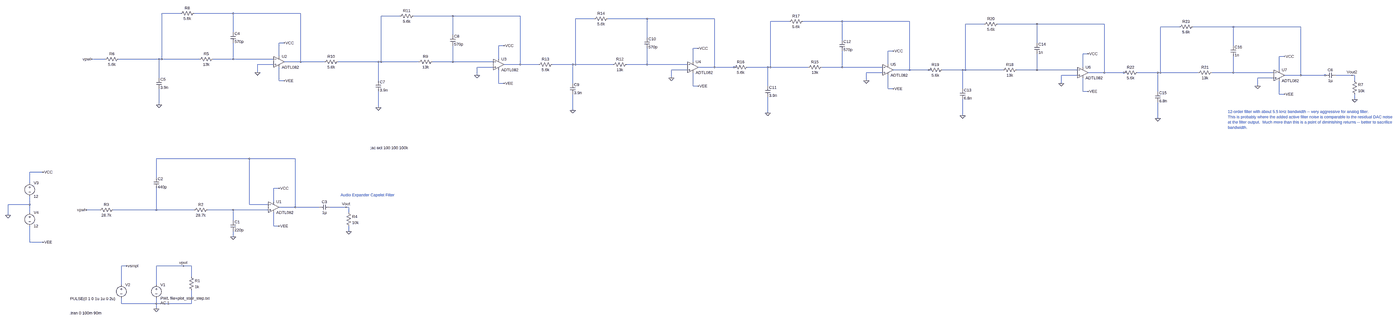
[diagram p0: schematic Audio_Cape_Output.asc, whole sheet]
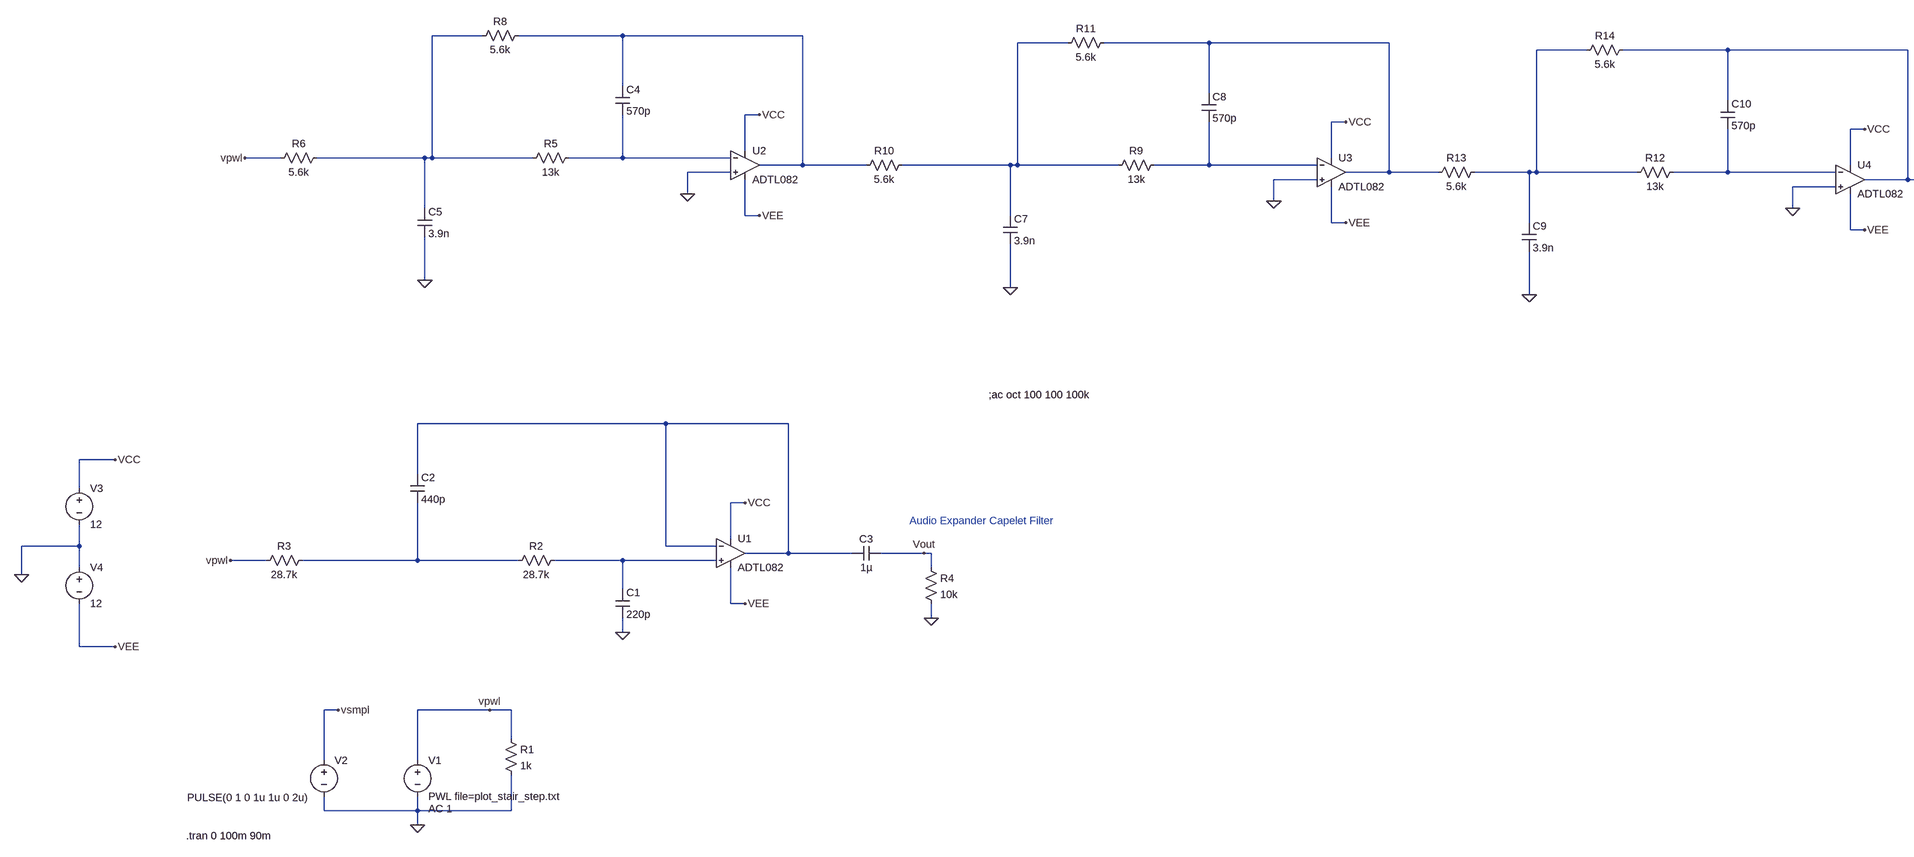
[diagram p1: schematic Audio_Cape_Output.asc, part, row 1 of 1, column 1 of 2]
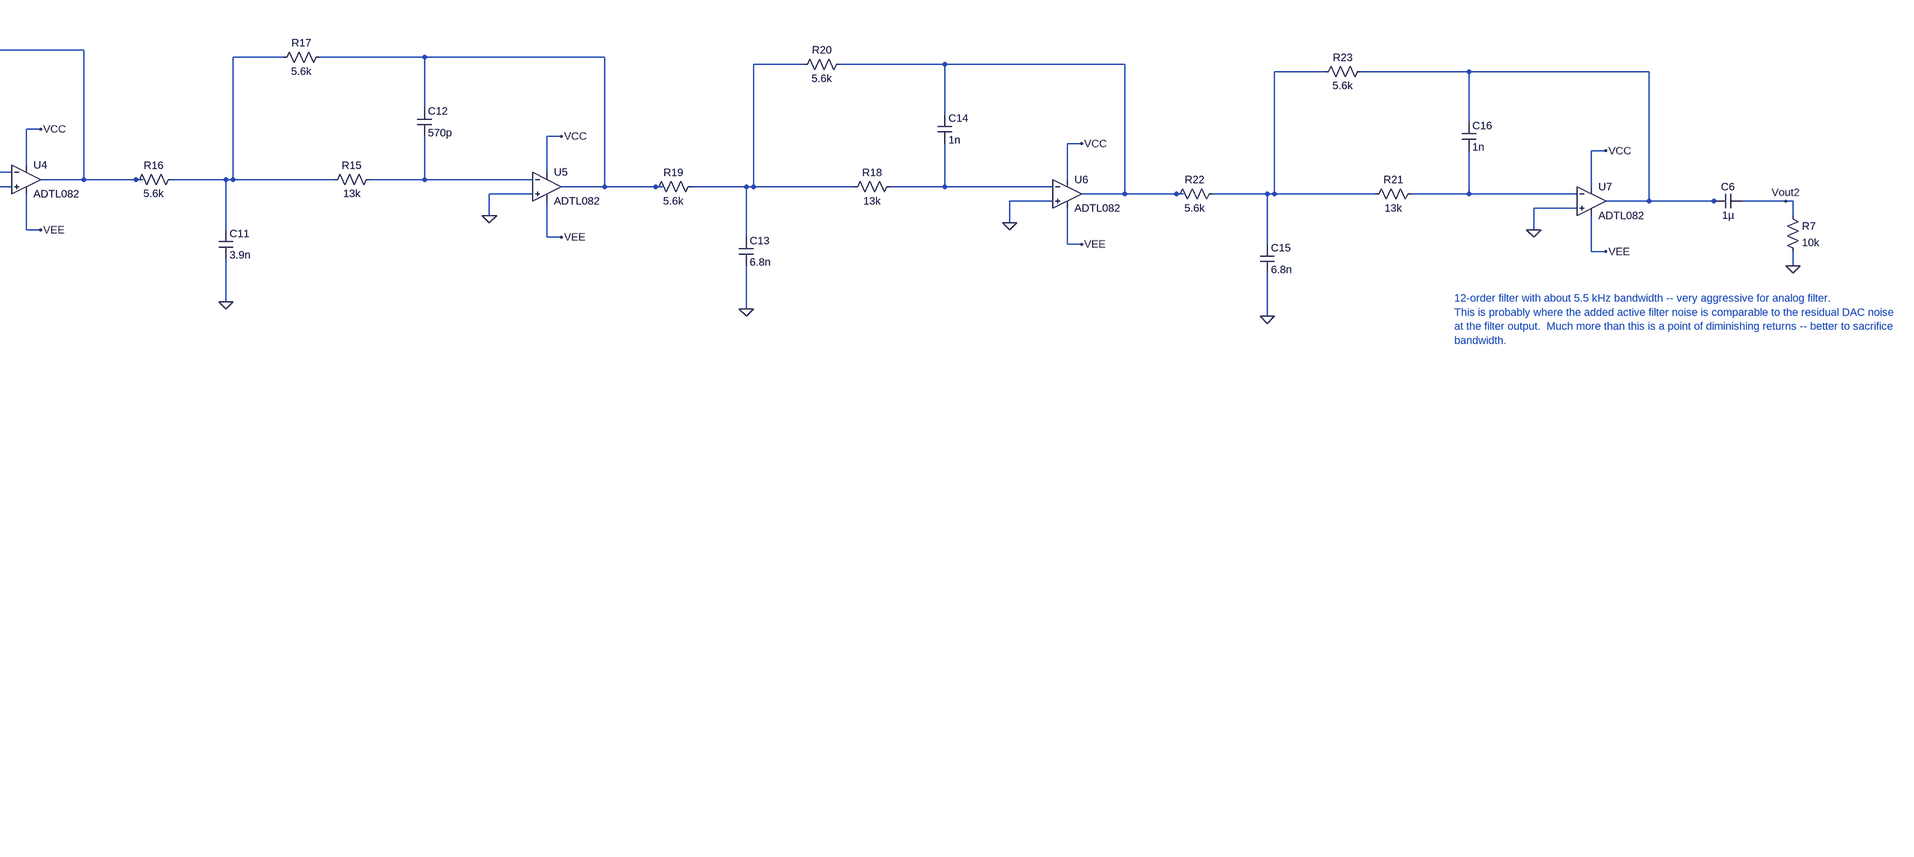
[diagram p2: schematic Audio_Cape_Output.asc, part, row 1 of 1, column 2 of 2]
Audio_Cape_Output.asc, the LTspice schematic file:
Version 4
SHEET 1 8220 680
WIRE 256 -1856 144 -1856
WIRE 576 -1856 336 -1856
WIRE 976 -1856 576 -1856
WIRE 1584 -1840 1472 -1840
WIRE 1904 -1840 1664 -1840
WIRE 2304 -1840 1904 -1840
WIRE 2912 -1824 2800 -1824
WIRE 3232 -1824 2992 -1824
WIRE 3632 -1824 3232 -1824
WIRE 4224 -1808 4112 -1808
WIRE 4544 -1808 4304 -1808
WIRE 4944 -1808 4544 -1808
WIRE 5552 -1792 5440 -1792
WIRE 5872 -1792 5632 -1792
WIRE 6272 -1792 5872 -1792
WIRE 6880 -1776 6768 -1776
WIRE 7200 -1776 6960 -1776
WIRE 7600 -1776 7200 -1776
WIRE 576 -1744 576 -1856
WIRE 1904 -1728 1904 -1840
WIRE 3232 -1712 3232 -1824
WIRE 4544 -1696 4544 -1808
WIRE 880 -1680 848 -1680
WIRE 5872 -1680 5872 -1792
WIRE 2208 -1664 2176 -1664
WIRE 7200 -1664 7200 -1776
WIRE 3536 -1648 3504 -1648
WIRE 4848 -1632 4816 -1632
WIRE 6176 -1616 6144 -1616
WIRE 848 -1600 848 -1680
WIRE 7504 -1600 7472 -1600
WIRE -192 -1584 -272 -1584
WIRE 128 -1584 -112 -1584
WIRE 144 -1584 144 -1856
WIRE 144 -1584 128 -1584
WIRE 368 -1584 144 -1584
WIRE 576 -1584 576 -1680
WIRE 576 -1584 448 -1584
WIRE 816 -1584 576 -1584
WIRE 2176 -1584 2176 -1664
WIRE 976 -1568 976 -1856
WIRE 976 -1568 880 -1568
WIRE 1136 -1568 976 -1568
WIRE 1456 -1568 1216 -1568
WIRE 1472 -1568 1472 -1840
WIRE 1472 -1568 1456 -1568
WIRE 1696 -1568 1472 -1568
WIRE 1904 -1568 1904 -1664
WIRE 1904 -1568 1776 -1568
WIRE 2144 -1568 1904 -1568
WIRE 3504 -1568 3504 -1648
WIRE 816 -1552 720 -1552
WIRE 2304 -1552 2304 -1840
WIRE 2304 -1552 2208 -1552
WIRE 2464 -1552 2304 -1552
WIRE 2784 -1552 2544 -1552
WIRE 2800 -1552 2800 -1824
WIRE 2800 -1552 2784 -1552
WIRE 3024 -1552 2800 -1552
WIRE 3232 -1552 3232 -1648
WIRE 3232 -1552 3104 -1552
WIRE 3472 -1552 3232 -1552
WIRE 4816 -1552 4816 -1632
WIRE 2144 -1536 2048 -1536
WIRE 3632 -1536 3632 -1824
WIRE 3632 -1536 3536 -1536
WIRE 3776 -1536 3632 -1536
WIRE 3792 -1536 3776 -1536
WIRE 4096 -1536 3856 -1536
WIRE 4112 -1536 4112 -1808
WIRE 4112 -1536 4096 -1536
WIRE 4336 -1536 4112 -1536
WIRE 4544 -1536 4544 -1632
WIRE 4544 -1536 4416 -1536
WIRE 4784 -1536 4544 -1536
WIRE 6144 -1536 6144 -1616
WIRE 3472 -1520 3376 -1520
WIRE 4944 -1520 4944 -1808
WIRE 4944 -1520 4848 -1520
WIRE 5104 -1520 4944 -1520
WIRE 5120 -1520 5104 -1520
WIRE 5424 -1520 5184 -1520
WIRE 5440 -1520 5440 -1792
WIRE 5440 -1520 5424 -1520
WIRE 5664 -1520 5440 -1520
WIRE 5872 -1520 5872 -1616
WIRE 5872 -1520 5744 -1520
WIRE 6112 -1520 5872 -1520
WIRE 7472 -1520 7472 -1600
WIRE 720 -1504 720 -1552
WIRE 4784 -1504 4688 -1504
WIRE 6272 -1504 6272 -1792
WIRE 6272 -1504 6176 -1504
WIRE 6432 -1504 6272 -1504
WIRE 6448 -1504 6432 -1504
WIRE 6752 -1504 6512 -1504
WIRE 6768 -1504 6768 -1776
WIRE 6768 -1504 6752 -1504
WIRE 6992 -1504 6768 -1504
WIRE 7200 -1504 7200 -1600
WIRE 7200 -1504 7072 -1504
WIRE 7440 -1504 7200 -1504
WIRE 2048 -1488 2048 -1536
WIRE 6112 -1488 6016 -1488
WIRE 7600 -1488 7600 -1776
WIRE 7600 -1488 7504 -1488
WIRE 7744 -1488 7600 -1488
WIRE 7760 -1488 7744 -1488
WIRE 7904 -1488 7808 -1488
WIRE 7920 -1488 7904 -1488
WIRE 128 -1472 128 -1584
WIRE 3376 -1472 3376 -1520
WIRE 7440 -1472 7344 -1472
WIRE 848 -1456 848 -1536
WIRE 880 -1456 848 -1456
WIRE 1456 -1456 1456 -1568
WIRE 4688 -1456 4688 -1504
WIRE 7920 -1456 7920 -1488
WIRE 2176 -1440 2176 -1520
WIRE 2208 -1440 2176 -1440
WIRE 2784 -1440 2784 -1552
WIRE 6016 -1440 6016 -1488
WIRE 3504 -1424 3504 -1504
WIRE 3536 -1424 3504 -1424
WIRE 4096 -1424 4096 -1536
WIRE 7344 -1424 7344 -1472
WIRE 4816 -1408 4816 -1488
WIRE 4848 -1408 4816 -1408
WIRE 5424 -1408 5424 -1520
WIRE 6144 -1392 6144 -1472
WIRE 6176 -1392 6144 -1392
WIRE 6752 -1392 6752 -1504
WIRE 7472 -1376 7472 -1456
WIRE 7504 -1376 7472 -1376
WIRE 7920 -1344 7920 -1376
WIRE 128 -1312 128 -1408
WIRE 1456 -1296 1456 -1392
WIRE 2784 -1280 2784 -1376
WIRE 4096 -1264 4096 -1360
WIRE 5424 -1248 5424 -1344
WIRE 6752 -1232 6752 -1328
WIRE 672 -848 112 -848
WIRE 944 -848 672 -848
WIRE -880 -768 -960 -768
WIRE 112 -736 112 -848
WIRE -960 -704 -960 -768
WIRE 848 -672 816 -672
WIRE 816 -592 816 -672
WIRE -960 -576 -960 -624
WIRE -960 -576 -1088 -576
WIRE 672 -576 672 -848
WIRE 784 -576 672 -576
WIRE 944 -560 944 -848
WIRE 944 -560 848 -560
WIRE 1104 -560 944 -560
WIRE 1264 -560 1168 -560
WIRE 1280 -560 1264 -560
WIRE -224 -544 -304 -544
WIRE 112 -544 112 -672
WIRE 112 -544 -144 -544
WIRE 336 -544 112 -544
WIRE 576 -544 416 -544
WIRE 784 -544 576 -544
WIRE -960 -528 -960 -576
WIRE 1280 -528 1280 -560
WIRE -1088 -512 -1088 -576
WIRE 576 -480 576 -544
WIRE 816 -448 816 -528
WIRE 848 -448 816 -448
WIRE 1280 -416 1280 -448
WIRE 576 -384 576 -416
WIRE -960 -352 -960 -448
WIRE -880 -352 -960 -352
WIRE -64 32 -96 32
WIRE 272 32 112 32
WIRE 320 32 272 32
WIRE 320 96 320 32
WIRE -96 144 -96 32
WIRE 112 144 112 32
WIRE -96 256 -96 224
WIRE 112 256 112 224
WIRE 112 256 -96 256
WIRE 320 256 320 176
WIRE 320 256 112 256
WIRE 112 288 112 256
FLAG 112 288 0
FLAG 272 32 vpwl
FLAG -64 32 vsmpl
FLAG 848 -672 VCC
FLAG 576 -384 0
FLAG 848 -448 VEE
FLAG -880 -768 VCC
FLAG -880 -352 VEE
FLAG -1088 -512 0
FLAG -304 -544 vpwl
FLAG 1280 -416 0
FLAG 1264 -560 Vout
FLAG 880 -1680 VCC
FLAG 880 -1456 VEE
FLAG -272 -1584 vpwl
FLAG 7920 -1344 0
FLAG 7904 -1488 Vout2
FLAG 720 -1504 0
FLAG 128 -1312 0
FLAG 2208 -1664 VCC
FLAG 2208 -1440 VEE
FLAG 2048 -1488 0
FLAG 1456 -1296 0
FLAG 3536 -1648 VCC
FLAG 3536 -1424 VEE
FLAG 3376 -1472 0
FLAG 2784 -1280 0
FLAG 4848 -1632 VCC
FLAG 4848 -1408 VEE
FLAG 4688 -1456 0
FLAG 4096 -1264 0
FLAG 6176 -1616 VCC
FLAG 6176 -1392 VEE
FLAG 6016 -1440 0
FLAG 5424 -1248 0
FLAG 7504 -1600 VCC
FLAG 7504 -1376 VEE
FLAG 7344 -1424 0
FLAG 6752 -1232 0
SYMBOL voltage 112 128 R0
WINDOW 123 24 124 Left 2
WINDOW 39 0 0 Left 2
SYMATTR InstName V1
SYMATTR Value PWL file=plot_stair_step.txt
SYMATTR Value2 AC 1
SYMBOL res 304 80 R0
SYMATTR InstName R1
SYMATTR Value 1k
SYMBOL voltage -96 128 R0
WINDOW 3 -304 99 Left 2
WINDOW 123 0 0 Left 2
WINDOW 39 0 0 Left 2
SYMATTR InstName V2
SYMATTR Value PULSE(0 1 0 1u 1u 0 2u)
SYMBOL Opamps\\ADTL082 816 -624 R0
SYMATTR InstName U1
SYMBOL cap 560 -480 R0
SYMATTR InstName C1
SYMATTR Value 220p
SYMBOL res 432 -560 R90
WINDOW 0 0 56 VBottom 2
WINDOW 3 32 56 VTop 2
SYMATTR InstName R2
SYMATTR Value 28.7k
SYMBOL res -128 -560 R90
WINDOW 0 0 56 VBottom 2
WINDOW 3 32 56 VTop 2
SYMATTR InstName R3
SYMATTR Value 28.7k
SYMBOL cap 96 -736 R0
SYMATTR InstName C2
SYMATTR Value 440p
SYMBOL voltage -960 -720 R0
WINDOW 123 0 0 Left 2
WINDOW 39 0 0 Left 2
SYMATTR InstName V3
SYMATTR Value 12
SYMBOL voltage -960 -544 R0
WINDOW 123 0 0 Left 2
WINDOW 39 0 0 Left 2
SYMATTR InstName V4
SYMATTR Value 12
SYMBOL cap 1168 -576 R90
WINDOW 0 0 32 VBottom 2
WINDOW 3 32 32 VTop 2
SYMATTR InstName C3
SYMATTR Value 1µ
SYMBOL res 1264 -544 R0
SYMATTR InstName R4
SYMATTR Value 10k
SYMBOL Opamps\\ADTL082 848 -1632 R0
SYMATTR InstName U2
SYMBOL res 464 -1600 R90
WINDOW 0 0 56 VBottom 2
WINDOW 3 32 56 VTop 2
SYMATTR InstName R5
SYMATTR Value 13k
SYMBOL res -96 -1600 R90
WINDOW 0 0 56 VBottom 2
WINDOW 3 32 56 VTop 2
SYMATTR InstName R6
SYMATTR Value 5.6k
SYMBOL cap 112 -1472 R0
SYMATTR InstName C5
SYMATTR Value 3.9n
SYMBOL cap 7808 -1504 R90
WINDOW 0 0 32 VBottom 2
WINDOW 3 32 32 VTop 2
SYMATTR InstName C6
SYMATTR Value 1µ
SYMBOL res 7904 -1472 R0
SYMATTR InstName R7
SYMATTR Value 10k
SYMBOL res 352 -1872 R90
WINDOW 0 0 56 VBottom 2
WINDOW 3 32 56 VTop 2
SYMATTR InstName R8
SYMATTR Value 5.6k
SYMBOL cap 560 -1744 R0
SYMATTR InstName C4
SYMATTR Value 570p
SYMBOL Opamps\\ADTL082 2176 -1616 R0
SYMATTR InstName U3
SYMBOL res 1792 -1584 R90
WINDOW 0 0 56 VBottom 2
WINDOW 3 32 56 VTop 2
SYMATTR InstName R9
SYMATTR Value 13k
SYMBOL res 1232 -1584 R90
WINDOW 0 0 56 VBottom 2
WINDOW 3 32 56 VTop 2
SYMATTR InstName R10
SYMATTR Value 5.6k
SYMBOL res 1680 -1856 R90
WINDOW 0 0 56 VBottom 2
WINDOW 3 32 56 VTop 2
SYMATTR InstName R11
SYMATTR Value 5.6k
SYMBOL cap 1888 -1728 R0
SYMATTR InstName C8
SYMATTR Value 570p
SYMBOL Opamps\\ADTL082 3504 -1600 R0
SYMATTR InstName U4
SYMBOL res 3120 -1568 R90
WINDOW 0 0 56 VBottom 2
WINDOW 3 32 56 VTop 2
SYMATTR InstName R12
SYMATTR Value 13k
SYMBOL res 2560 -1568 R90
WINDOW 0 0 56 VBottom 2
WINDOW 3 32 56 VTop 2
SYMATTR InstName R13
SYMATTR Value 5.6k
SYMBOL res 3008 -1840 R90
WINDOW 0 0 56 VBottom 2
WINDOW 3 32 56 VTop 2
SYMATTR InstName R14
SYMATTR Value 5.6k
SYMBOL cap 3216 -1712 R0
SYMATTR InstName C10
SYMATTR Value 570p
SYMBOL Opamps\\ADTL082 4816 -1584 R0
SYMATTR InstName U5
SYMBOL res 4432 -1552 R90
WINDOW 0 0 56 VBottom 2
WINDOW 3 32 56 VTop 2
SYMATTR InstName R15
SYMATTR Value 13k
SYMBOL res 3872 -1552 R90
WINDOW 0 0 56 VBottom 2
WINDOW 3 32 56 VTop 2
SYMATTR InstName R16
SYMATTR Value 5.6k
SYMBOL res 4320 -1824 R90
WINDOW 0 0 56 VBottom 2
WINDOW 3 32 56 VTop 2
SYMATTR InstName R17
SYMATTR Value 5.6k
SYMBOL cap 4528 -1696 R0
SYMATTR InstName C12
SYMATTR Value 570p
SYMBOL Opamps\\ADTL082 6144 -1568 R0
SYMATTR InstName U6
SYMBOL res 5760 -1536 R90
WINDOW 0 0 56 VBottom 2
WINDOW 3 32 56 VTop 2
SYMATTR InstName R18
SYMATTR Value 13k
SYMBOL res 5200 -1536 R90
WINDOW 0 0 56 VBottom 2
WINDOW 3 32 56 VTop 2
SYMATTR InstName R19
SYMATTR Value 5.6k
SYMBOL res 5648 -1808 R90
WINDOW 0 0 56 VBottom 2
WINDOW 3 32 56 VTop 2
SYMATTR InstName R20
SYMATTR Value 5.6k
SYMBOL cap 5856 -1680 R0
SYMATTR InstName C14
SYMATTR Value 1n
SYMBOL Opamps\\ADTL082 7472 -1552 R0
SYMATTR InstName U7
SYMBOL res 7088 -1520 R90
WINDOW 0 0 56 VBottom 2
WINDOW 3 32 56 VTop 2
SYMATTR InstName R21
SYMATTR Value 13k
SYMBOL res 6528 -1520 R90
WINDOW 0 0 56 VBottom 2
WINDOW 3 32 56 VTop 2
SYMATTR InstName R22
SYMATTR Value 5.6k
SYMBOL cap 6736 -1392 R0
SYMATTR InstName C15
SYMATTR Value 6.8n
SYMBOL res 6976 -1792 R90
WINDOW 0 0 56 VBottom 2
WINDOW 3 32 56 VTop 2
SYMATTR InstName R23
SYMATTR Value 5.6k
SYMBOL cap 7184 -1664 R0
SYMATTR InstName C16
SYMATTR Value 1n
SYMBOL cap 1440 -1456 R0
SYMATTR InstName C7
SYMATTR Value 3.9n
SYMBOL cap 2768 -1440 R0
SYMATTR InstName C9
SYMATTR Value 3.9n
SYMBOL cap 4080 -1424 R0
SYMATTR InstName C11
SYMATTR Value 3.9n
SYMBOL cap 5408 -1408 R0
SYMATTR InstName C13
SYMATTR Value 6.8n
TEXT -402 312 Left 2 !.tran 0 100m 90m
TEXT 1408 -912 Left 2 !;ac oct 100 100 100k
TEXT 1232 -632 Left 2 ;Audio Expander Capelet Filter
TEXT 7168 -1272 Left 2 ;12-order filter with about 5.5 kHz bandwidth -- very aggressive for analog filter.\nThis is probably where the added active filter noise is comparable to the residual DAC noise\nat the filter output.  Much more than this is a point of diminishing returns -- better to sacrifice \nbandwidth.

The netlist it stands for:
* Audio_Cape_Output.asc
V1 vpwl 0 PWL file=plot_stair_step.txt AC 1
R1 vpwl 0 1k
V2 vsmpl 0 PULSE(0 1 0 1u 1u 0 2u)
XU1 N021 N019 VCC VEE N019 ADTL082  ; pins In+ In- V+ V- OUT
C1 N021 0 220p
R2 N021 N020 28.7k
R3 N020 vpwl 28.7k
C2 N019 N020 440p
V3 VCC 0 12
V4 0 VEE 12
C3 Vout N019 1µ
R4 Vout 0 10k
XU2 0 N013 VCC VEE N002 ADTL082  ; pins In+ In- V+ V- OUT
R5 N013 N001 13k
R6 N001 vpwl 5.6k
C5 N001 0 3.9n
C6 Vout2 N012 1µ
R7 Vout2 0 10k
R8 N002 N001 5.6k
C4 N002 N013 570p
XU3 0 N014 VCC VEE N004 ADTL082  ; pins In+ In- V+ V- OUT
R9 N014 N003 13k
R10 N003 N002 5.6k
R11 N004 N003 5.6k
C8 N004 N014 570p
XU4 0 N015 VCC VEE N006 ADTL082  ; pins In+ In- V+ V- OUT
R12 N015 N005 13k
R13 N005 N004 5.6k
R14 N006 N005 5.6k
C10 N006 N015 570p
XU5 0 N016 VCC VEE N008 ADTL082  ; pins In+ In- V+ V- OUT
R15 N016 N007 13k
R16 N007 N006 5.6k
R17 N008 N007 5.6k
C12 N008 N016 570p
XU6 0 N017 VCC VEE N010 ADTL082  ; pins In+ In- V+ V- OUT
R18 N017 N009 13k
R19 N009 N008 5.6k
R20 N010 N009 5.6k
C14 N010 N017 1n
XU7 0 N018 VCC VEE N012 ADTL082  ; pins In+ In- V+ V- OUT
R21 N018 N011 13k
R22 N011 N010 5.6k
C15 N011 0 6.8n
R23 N012 N011 5.6k
C16 N012 N018 1n
C7 N003 0 3.9n
C9 N005 0 3.9n
C11 N007 0 3.9n
C13 N009 0 6.8n
.tran 0 100m 90m
;ac oct 100 100 100k
* Audio Expander Capelet Filter
* 12-order filter with about 5.5 kHz bandwidth -- very aggressive for analog filter.
* This is probably where the added active filter noise is comparable to the residual DAC noise
* at the filter output.  Much more than this is a point of diminishing returns -- better to sacrifice
* bandwidth.
.lib ADI.lib
.backanno
.end